# EasyEDA schematic new.json
TITLE: STUDY BUDDY; REV: 1.0; Date: 2022-05-29; Sheet: 1/1; Drawn By: BETTY; Company: DEAKIN UNIVERSITY
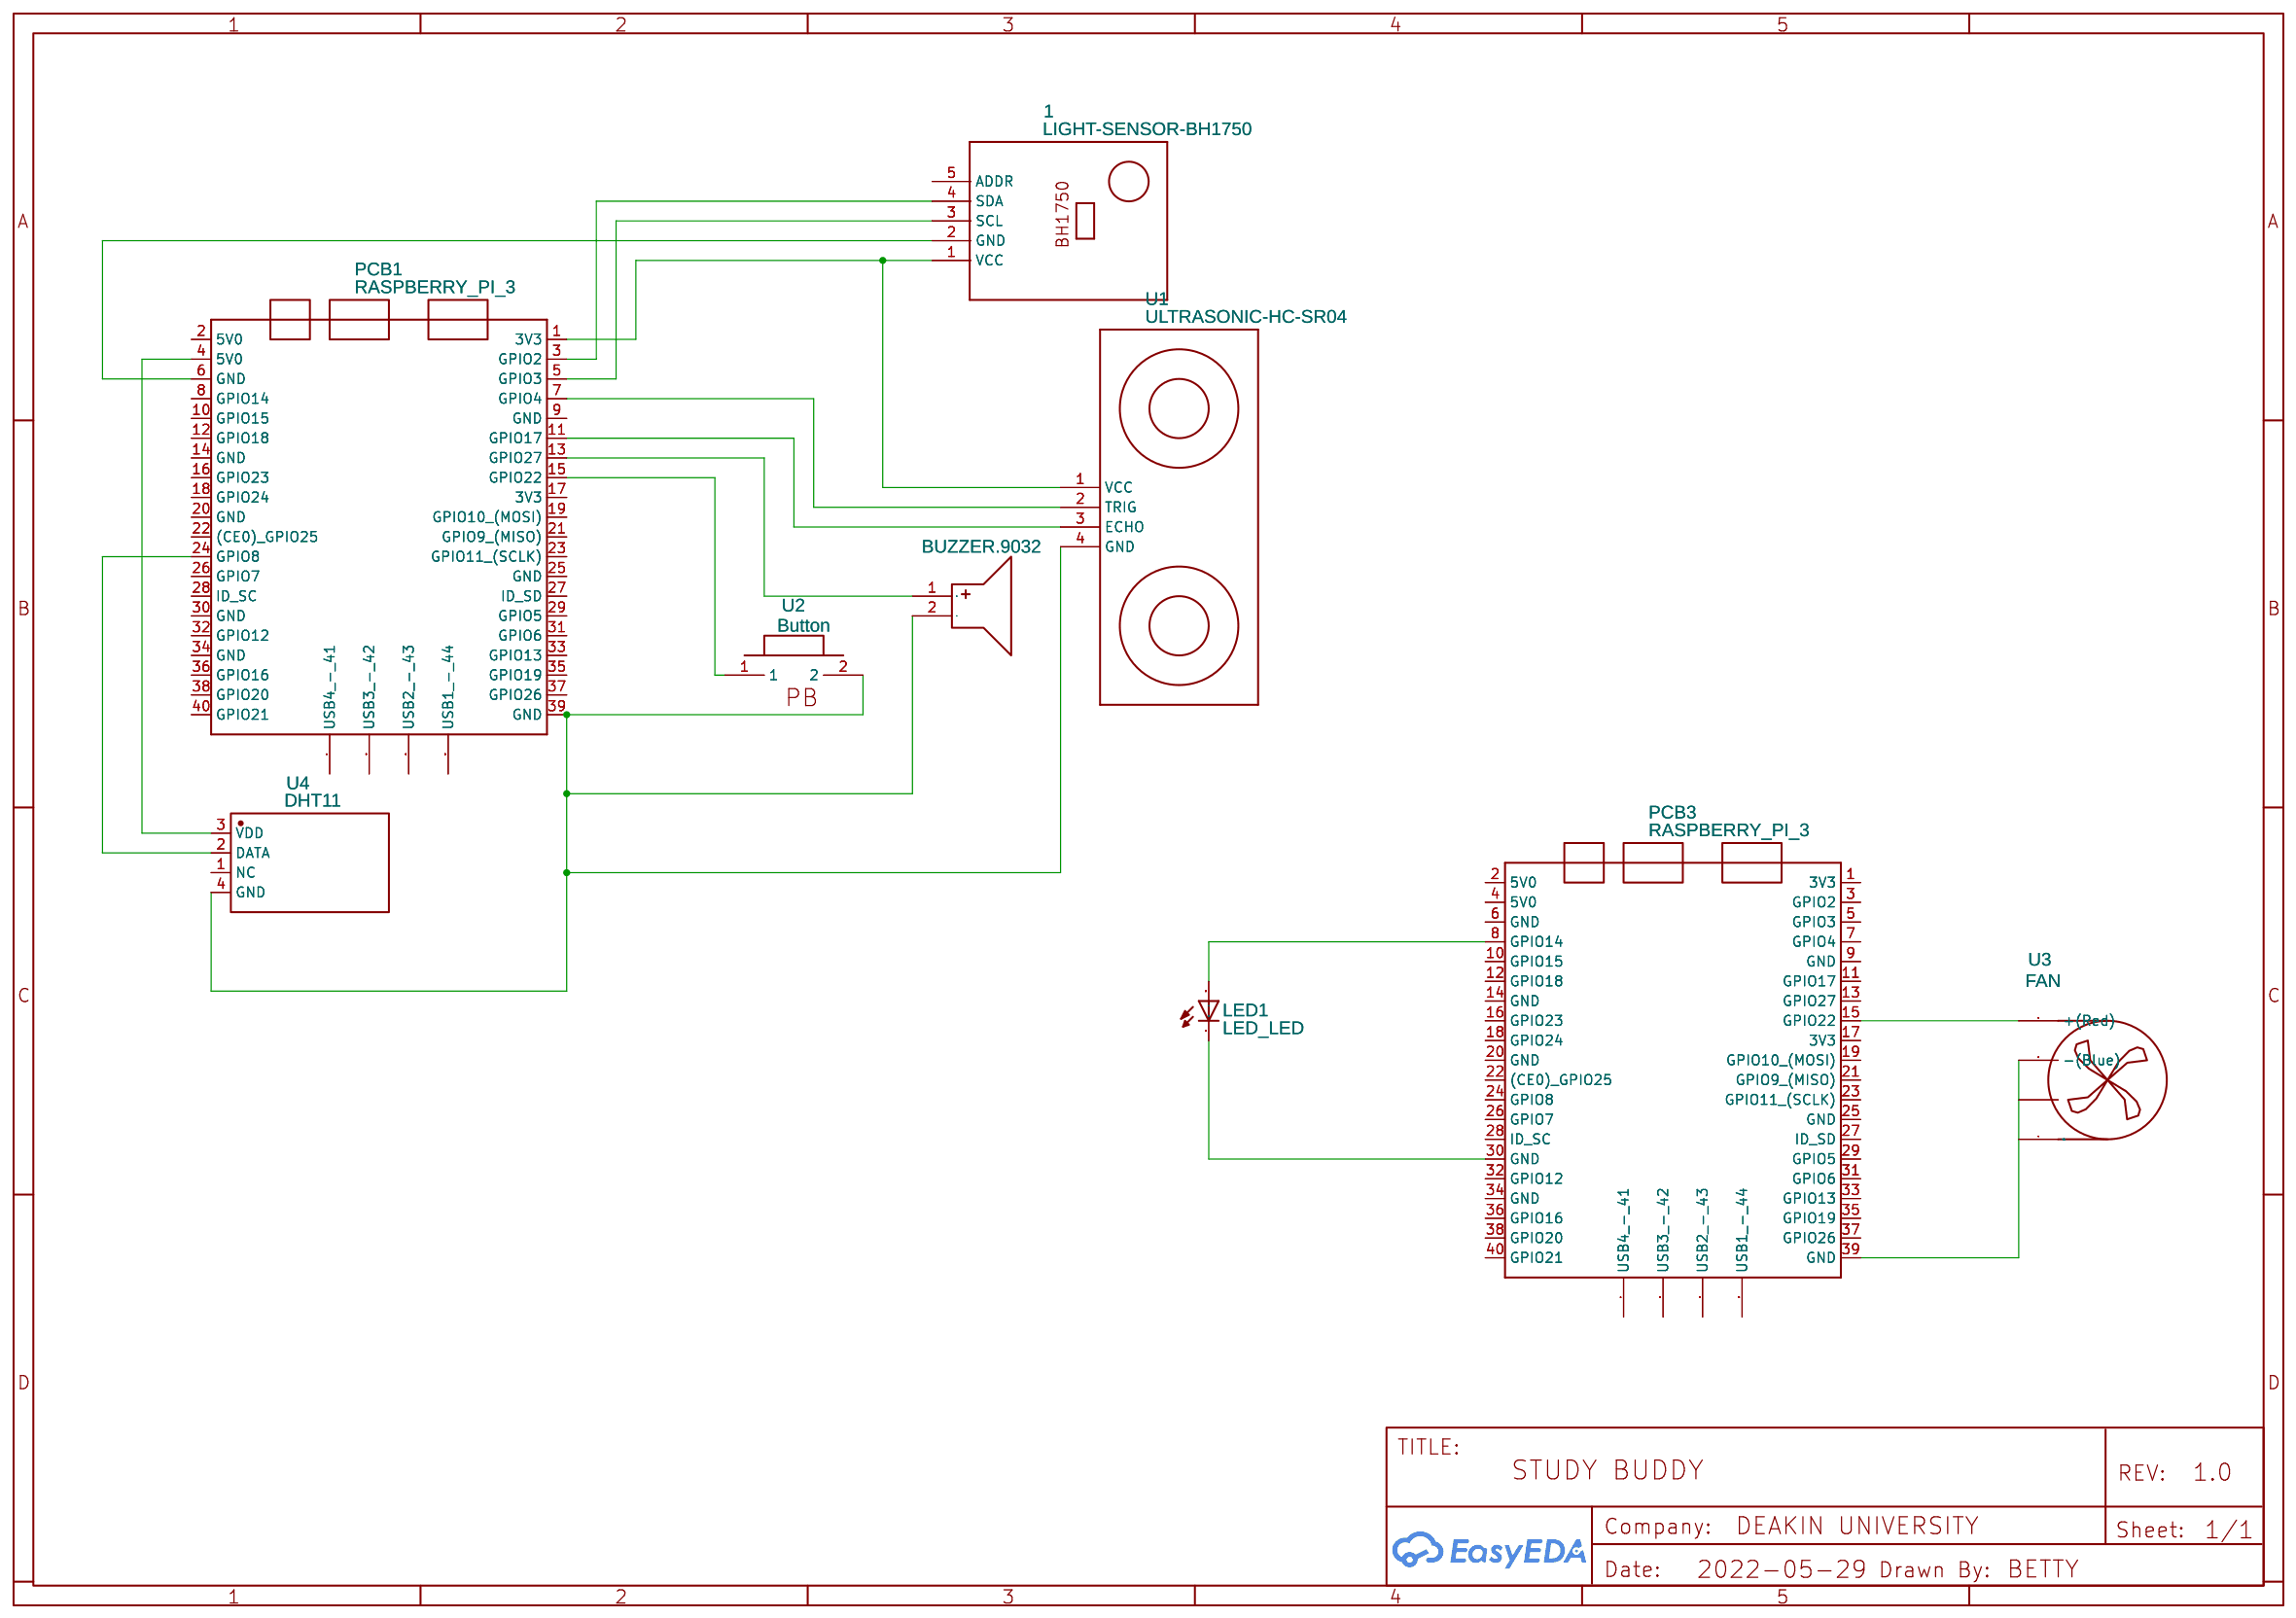
[diagram p0: schematic sheet]

## Parts
1  LIGHT-SENSOR-BH1750  [LIGHT-SENSOR-BH1750]
BUZZER1  BUZZER.9032  [BUZ-SMD_2P-L10.5-W9.0-P10.50-R]
LED1  LED_LED  [LED_SMARTLED-TTW]
PCB1  RASPBERRY_PI_3  [RASPBERRY_PI_B+]
PCB3  RASPBERRY_PI_3  [RASPBERRY_PI_B+]
U1  ULTRASONIC-HC-SR04  [ULTRASONIC-HC-SR04]
U2  Button  [GPTS203211B-PUSHBUTTON-ON-OFF]
U3  FAN  [FAN 2 PIN]
U4  DHT11  [SENSOR-TH_DHT11]

## Library data of the parts
1 = LIGHT-SENSOR-BH1750: Contributor: Krzysztof
BUZZER1 = BUZZER.9032: Supplier: LCSC; Supplier Part: C9900002564; Contributor: LCSC; JLCPCB Part Class: Extended Part
LED1 = LED_LED: Contributor: denney.inky
PCB1 PCB3 = RASPBERRY_PI_3: Raspberry Pi B+; sourceId: a8qICUO6o; Contributor: akshay8284
U1 = ULTRASONIC-HC-SR04: Ultrasonic Ranging Module HC-SR04; sourceId: iECXHFpLv; Contributor: Phutthawan HOGCHUN
U2 = GPTS203211B Push Button On-Off: Manufacturer: CW Industries; Manufacturer Part: GPTS203211B; Supplier: Digi-Key; Supplier Part: CW181-ND; link: https://www.digikey.com/htmldatasheets/production/1066328/0/0/1/gpts203211b-drawing.html; Contributor: Mesmero
U3 = 4 PIN FAN: Contributor: cucar14
U4 = DHT11: Supplier: LCSC; Supplier Part: C117051; Manufacturer: Aosong (Guangzhou) Elec; Contributor: LCSC; JLCPCB Part Class: Extended Part

## Nets
Net-(1-1): 1.1(VCC) PCB1.1(3V3) U1.1(VCC)
Net-(1-2): 1.2(GND) PCB1.6(GND)
Net-(1-3): 1.3(SCL) PCB1.5(GPIO3)
Net-(1-4): 1.4(SDA) PCB1.3(GPIO2)
Net-(BUZZER1-1): BUZZER1.1(+) PCB1.13(GPIO27)
Net-(BUZZER1-2): BUZZER1.2(-) PCB1.39(GND) U1.4(GND) U2.2 U4.4(GND)
Net-(LED1-A@1): LED1.A@1(A) PCB3.8(GPIO14)
Net-(LED1-C@1): LED1.C@1(C) PCB3.30(GND)
Net-(PCB1-4): PCB1.4(5V0) U4.3(VDD)
Net-(PCB1-7): PCB1.7(GPIO4) U1.2(TRIG)
Net-(PCB1-11): PCB1.11(GPIO17) U1.3(ECHO)
Net-(PCB1-15): PCB1.15(GPIO22) U2.1
Net-(PCB1-24): PCB1.24(GPIO8) U4.2(DATA)
Net-(PCB3-15): PCB3.15(GPIO22) U3.1(+(Red))
Net-(PCB3-39): PCB3.39(GND) U3.2(-(Blue))

Not connected (* = marked no-connect by the designer): 1 5(ADDR); PCB1 2(5V0) 8(GPIO14) 9(GND) 10(GPIO15) 12(GPIO18) 14(GND) 16(GPIO23) 17(3V3) 18(GPIO24) 19(GPIO10 (MOSI)) 20(GND) 21(GPIO9 (MISO)) 22((CE0) GPIO25) 23(GPIO11 (SCLK)) 25(GND) 26(GPIO7) 27(ID_SD) 28(ID_SC) 29(GPIO5) 30(GND) 31(GPIO6) 32(GPIO12) 33(GPIO13) 34(GND) 35(GPIO19) 36(GPIO16) 37(GPIO26) 38(GPIO20) 40(GPIO21) 43(USB2 - 43) 44(USB4 - 41) 45(USB3 - 42) 46(USB1 - 44); PCB3 1(3V3) 2(5V0) 3(GPIO2) 4(5V0) 5(GPIO3) 6(GND) 7(GPIO4) 9(GND) 10(GPIO15) 11(GPIO17) 12(GPIO18) 13(GPIO27) 14(GND) 16(GPIO23) 17(3V3) 18(GPIO24) 19(GPIO10 (MOSI)) 20(GND) 21(GPIO9 (MISO)) 22((CE0) GPIO25) 23(GPIO11 (SCLK)) 24(GPIO8) 25(GND) 26(GPIO7) 27(ID_SD) 28(ID_SC) 29(GPIO5) 31(GPIO6) 32(GPIO12) 33(GPIO13) 34(GND) 35(GPIO19) 36(GPIO16) 37(GPIO26) 38(GPIO20) 40(GPIO21) 43(USB2 - 43) 44(USB4 - 41) 45(USB3 - 42) 46(USB1 - 44); U3  4(Tac (White)); U4 1(NC)
